# EAGLE schematic motorcircuit_withlogic_old (EAGLE 6.1)
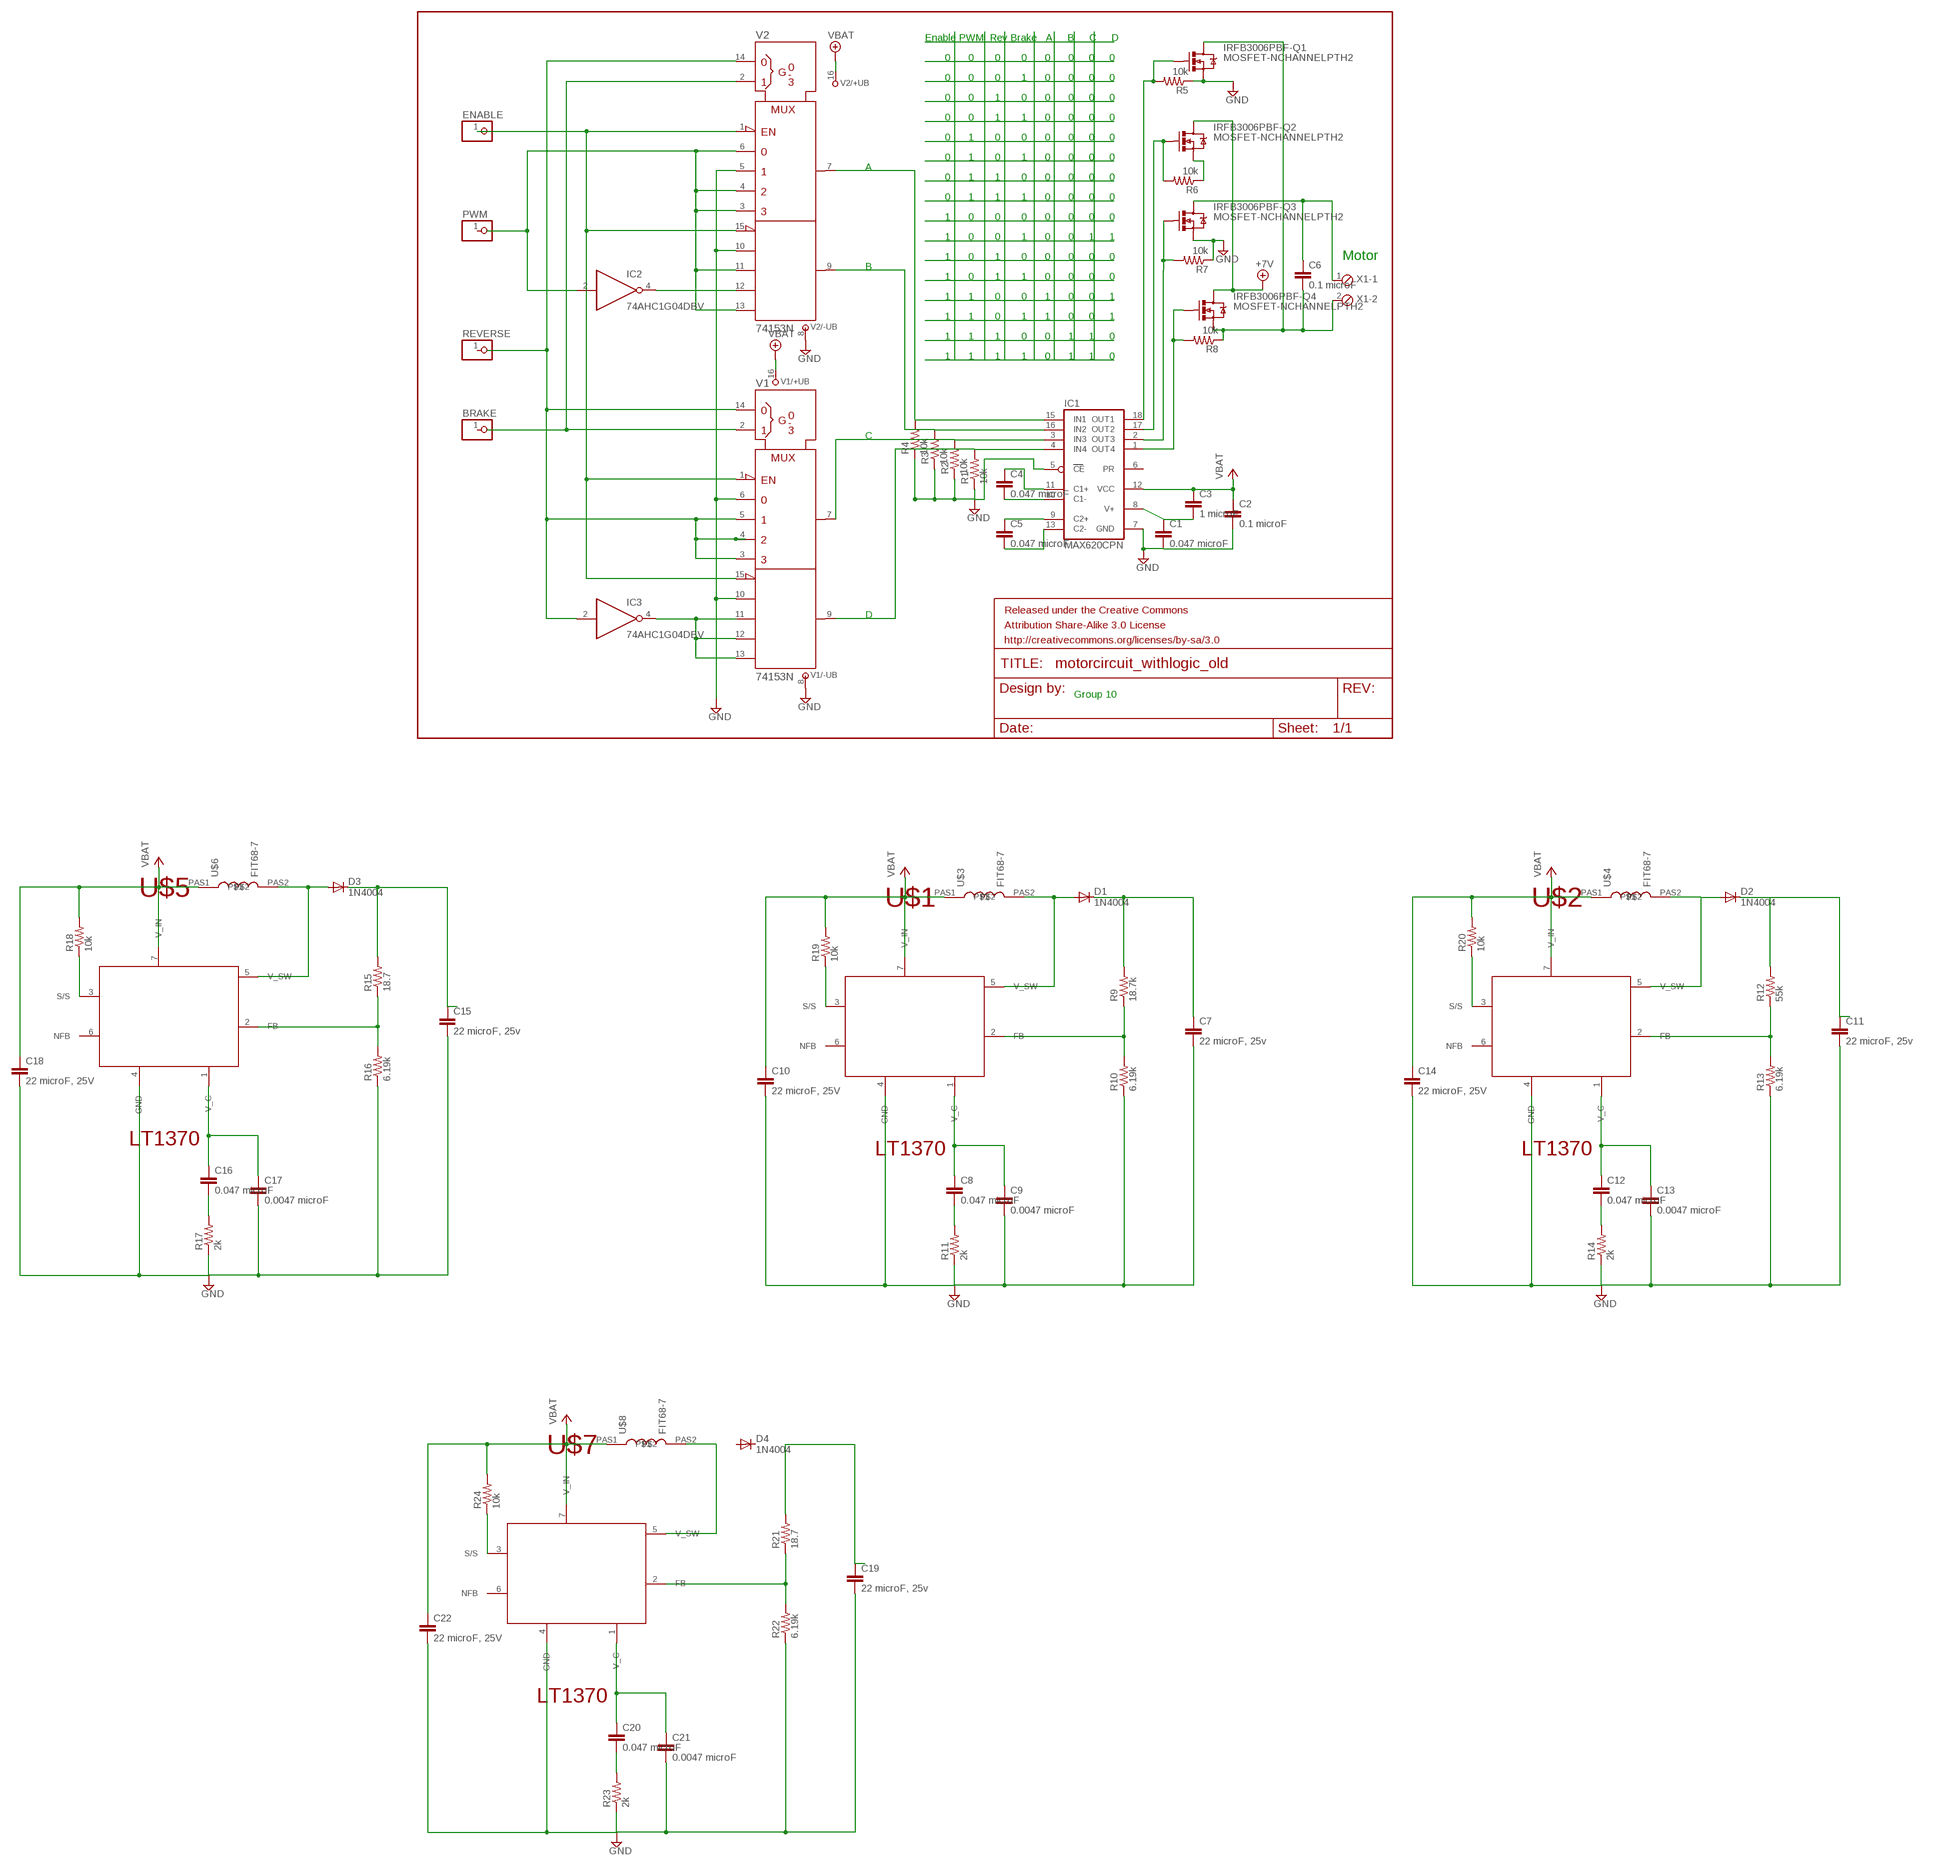
[diagram p0: schematic, sheet 1]

## Parts
BRAKE  PINHD-1X1  [1X01]
C1  0.047 microF  CAP0603-CAP  [0603-CAP]
C2  0.1 microF  CAP0603-CAP  [0603-CAP]
C3  1 microF  CAP0603-CAP  [0603-CAP]
C4  0.047 microF  CAP0603-CAP  [0603-CAP]
C5  0.047 microF  CAP0603-CAP  [0603-CAP]
C6  0.1 microF  CAP0603-CAP  [0603-CAP]
C7  22 microF, 25v  CAP0603-CAP  [0603-CAP]
C8  0.047 microF  CAP0603-CAP  [0603-CAP]
C9  0.0047 microF  CAP0603-CAP  [0603-CAP]
C10  22 microF, 25V  CAP0603-CAP  [0603-CAP]
C11  22 microF, 25v  CAP0603-CAP  [0603-CAP]
C12  0.047 microF  CAP0603-CAP  [0603-CAP]
C13  0.0047 microF  CAP0603-CAP  [0603-CAP]
C14  22 microF, 25V  CAP0603-CAP  [0603-CAP]
C15  22 microF, 25v  CAP0603-CAP  [0603-CAP]
C16  0.047 microF  CAP0603-CAP  [0603-CAP]
C17  0.0047 microF  CAP0603-CAP  [0603-CAP]
C18  22 microF, 25V  CAP0603-CAP  [0603-CAP]
C19  22 microF, 25v  CAP0603-CAP  [0603-CAP]
C20  0.047 microF  CAP0603-CAP  [0603-CAP]
C21  0.0047 microF  CAP0603-CAP  [0603-CAP]
C22  22 microF, 25V  CAP0603-CAP  [0603-CAP]
D1  1N4004  [DO41-10]
D2  1N4004  [DO41-10]
D3  1N4004  [DO41-10]
D4  1N4004  [DO41-10]
ENABLE  PINHD-1X1  [1X01]
IC1  MAX620CPN  [DIL18]
IC2  74AHC1G04DBV  [SOT23-5]
IC3  74AHC1G04DBV  [SOT23-5]
IRFB3006PBF-Q1  MOSFET-NCHANNELPTH2  [TO220V]
IRFB3006PBF-Q2  MOSFET-NCHANNELPTH2  [TO220V]
IRFB3006PBF-Q3  MOSFET-NCHANNELPTH2  [TO220V]
IRFB3006PBF-Q4  MOSFET-NCHANNELPTH2  [TO220V]
PWM  PINHD-1X1  [1X01]
R1  10k  RESISTOR0603-RES  [0603-RES]
R2  10k  RESISTOR0603-RES  [0603-RES]
R3  10k  RESISTOR0603-RES  [0603-RES]
R4  10k  RESISTOR0603-RES  [0603-RES]
R5  10k  RESISTOR0603-RES  [0603-RES]
R6  10k  RESISTOR0603-RES  [0603-RES]
R7  10k  RESISTOR0603-RES  [0603-RES]
R8  10k  RESISTOR0603-RES  [0603-RES]
R9  18.7k  RESISTOR0603-RES  [0603-RES]
R10  6.19k  RESISTOR0603-RES  [0603-RES]
R11  2k  RESISTOR0603-RES  [0603-RES]
R12  55k  RESISTOR0603-RES  [0603-RES]
R13  6.19k  RESISTOR0603-RES  [0603-RES]
R14  2k  RESISTOR0603-RES  [0603-RES]
R15  18.7  RESISTOR0603-RES  [0603-RES]
R16  6.19k  RESISTOR0603-RES  [0603-RES]
R17  2k  RESISTOR0603-RES  [0603-RES]
R18  10k  RESISTOR0603-RES  [0603-RES]
R19  10k  RESISTOR0603-RES  [0603-RES]
R20  10k  RESISTOR0603-RES  [0603-RES]
R21  18.7  RESISTOR0603-RES  [0603-RES]
R22  6.19k  RESISTOR0603-RES  [0603-RES]
R23  2k  RESISTOR0603-RES  [0603-RES]
R24  10k  RESISTOR0603-RES  [0603-RES]
REVERSE  PINHD-1X1  [1X01]
U$1  LT1370  [TO220-7]
U$2  LT1370  [TO220-7]
U$3  FIT68-7  [TOROID_INDUCTOR]
U$4  FIT68-7  [TOROID_INDUCTOR]
U$5  LT1370  [TO220-7]
U$6  FIT68-7  [TOROID_INDUCTOR]
U$7  LT1370  [TO220-7]
U$8  FIT68-7  [TOROID_INDUCTOR]
V1  74153N  [DIL16]
V2  74153N  [DIL16]
X1  MPT2  [2POL254]

## Nets
+7V: IRFB3006PBF-Q2.2(D) IRFB3006PBF-Q4.2(D)
GND: C1.2 C2.2 C7.2 C9.2 C10.2 C11.2 C13.2 C14.2 C15.2 C17.2 C18.2 C19.2 C21.2 C22.2 IC1.5(CE) IC1.7(GND) IRFB3006PBF-Q1.3(S) IRFB3006PBF-Q3.3(S) R1.1 R2.1 R3.1 R4.1 R5.1 R7.1 R10.1 R11.1 R13.1 R14.1 R16.1 R17.1 R22.1 R23.1 V1.6(1C0) V1.8(-UB) V1.10(2C0) V2.5(1C1) V2.8(-UB) V2.10(2C0)
N$1: IC1.18(OUT1) IRFB3006PBF-Q1.1(G) R5.2
N$2: IC1.17(OUT2) IRFB3006PBF-Q2.1(G) R6.2
N$3: IC1.2(OUT3) IRFB3006PBF-Q3.1(G) R7.2
N$4: IC1.1(OUT4) IRFB3006PBF-Q4.1(G) R8.2
N$5: IC1.3(IN3) R2.2 V1.7(1Y)
N$6: IC1.4(IN4) R1.2 V1.9(2Y)
N$7: C4.2 IC1.10(C1-)
N$8: C4.1 IC1.11(C1+)
N$9: C5.1 IC1.9(C2+)
N$10: C5.2 IC1.13(C2-)
N$11: IC1.16(IN2) R3.2 V2.9(2Y)
N$12: IC1.15(IN1) R4.2 V2.7(1Y)
N$13: C6.1 IRFB3006PBF-Q3.2(D) X1.1
N$14: IRFB3006PBF-Q2.3(S) R6.1
N$15: IC2.2(I) V2.3(1C3) V2.4(1C2) V2.6(1C0) V2.11(2C1) V2.13(2C3)
N$20: ENABLE.1 V1.1(!1G) V1.15(!2G) V2.1(!1G) V2.15(!2G)
N$21: V1.2(B) V2.2(B)
N$22: IC3.2(I) V1.3(1C3) V1.4(1C2) V1.5(1C1) V1.14(A) V2.14(A)
N$23: IC2.4(O) V2.12(2C2)
N$24: IC3.4(O) V1.11(2C1) V1.12(2C2) V1.13(2C3)
N$26: C6.2 IRFB3006PBF-Q1.2(D) IRFB3006PBF-Q4.3(S) R8.1 X1.2
N$27: C8.2 R11.2
N$28: C8.1 C9.1
N$29: R20.1
N$30: D1.A U$3.PAS2
N$31: R9.1 R10.2
N$32: C12.2 R14.2
N$33: C12.1 C13.1
N$34: D1.C R9.2
N$35: R12.1 R13.2
N$36: D2.C R12.2
N$37: R19.1
N$38: D2.A U$4.PAS2
N$39: C16.2 R17.2
N$40: C16.1 C17.1
N$41: R15.1 R16.2
N$42: D3.C R15.2
N$43: R18.1
N$44: D3.A U$6.PAS2
N$45: C20.2 R23.2
N$46: C20.1 C21.1
N$47: R21.1 R22.2
N$48: R21.2
N$49: U$8.PAS2
N$50: R24.1
V+: C1.1 C3.2 IC1.8(V+)
VBAT: V1.16(+UB) V2.16(+UB)
VCC: C2.1 C3.1 C10.1 C14.1 C18.1 C22.1 IC1.12(VCC) R18.2 R19.2 R20.2 R24.2 U$3.PAS1 U$4.PAS1 U$6.PAS1 U$8.PAS1 ; supply symbol labelled VBAT
Unconnected: BRAKE.1 C7.1 C11.1 C15.1 C19.1 D4.A D4.C IC1.6(PR) PWM.1 REVERSE.1 U$1.1(V_C) U$1.2(FB) U$1.3(S/S) U$1.4(GND) U$1.5(V_SW) U$1.6(NFB) U$1.7(V_IN) U$2.1(V_C) U$2.2(FB) U$2.3(S/S) U$2.4(GND) U$2.5(V_SW) U$2.6(NFB) U$2.7(V_IN) U$5.1(V_C) U$5.2(FB) U$5.3(S/S) U$5.4(GND) U$5.5(V_SW) U$5.6(NFB) U$5.7(V_IN) U$7.1(V_C) U$7.2(FB) U$7.3(S/S) U$7.4(GND) U$7.5(V_SW) U$7.6(NFB) U$7.7(V_IN)

## Notes on the sheet
- Enable PWM  Rev Brake   A     B     C     D
- 0      0       0       0      0      0     0     0
- 0      0       0       1      0      0     0     0
- 0      0       1       0      0      0     0     0
- 0      0       1       1      0      0     0     0
- 0      1       0       0      0      0     0     0
- 0      1       0       1      0      0     0     0
- A
- 0      1       1       0      0      0     0     0
- 0      1       1       1      0      0     0     0
- 1      0       0       0      0      0     0     0
- 1      0       0       1      0      0     1     1
- 1      0       1       0      0      0     0     0 | Motor
- B
- 1      0       1       1      0      0     0     0
- 1      1       0       0      1      0     0     1
- 1      1       0       1      1      0     0     1
- 1      1       1       0      0      1     1     0
- 1      1       1       1      0      1     1     0
- C
- D
- Group 10

## Power pins joined to a net without a drawn wire
GND: IC2.3(GND) IC3.3(GND)
VCC: IC2.5(VCC) IC3.5(VCC)

## Library data of the parts
BRAKE ENABLE PWM REVERSE = pinhead:PINHD-1X1: PIN HEADER
C1-C22 = SparkFun:CAP: Capacitor Standard 0603 ceramic capacitor, and 0.1" leaded capacitor.
D1-D4 = diode:1N4004: DIODE general purpose rectifier, 1 A
IC1 = maxim:MAX620CPN: MOSFET DRIVER; MPN: MAX620CPN+; OC_FARNELL: unknown; OC_NEWARK: 27M4142
IC2 IC3 = 74xx-little-us:74*1G04: INVERTER Gate
IRFB3006PBF-Q1-IRFB3006PBF-Q4 = SparkFun:MOSFET-NCHANNEL
R1-R24 = SparkFun:RESISTOR: Resistor Basic schematic elements and footprints for 0603, 1206, and PTH resistors.
U$1 U$2 U$5 U$7 = group10:LT1370
U$3 U$4 U$6 U$8 = group10:FIT68-7
V1 V2 = 74ttl-din:74*153: Dual 4-line to 1-line data SELECTOR/MULTIPLEXER
X1 = con-phoenix-254:MPT2: PHOENIX CONNECTOR; OC_FARNELL: unknown; OC_NEWARK: unknown